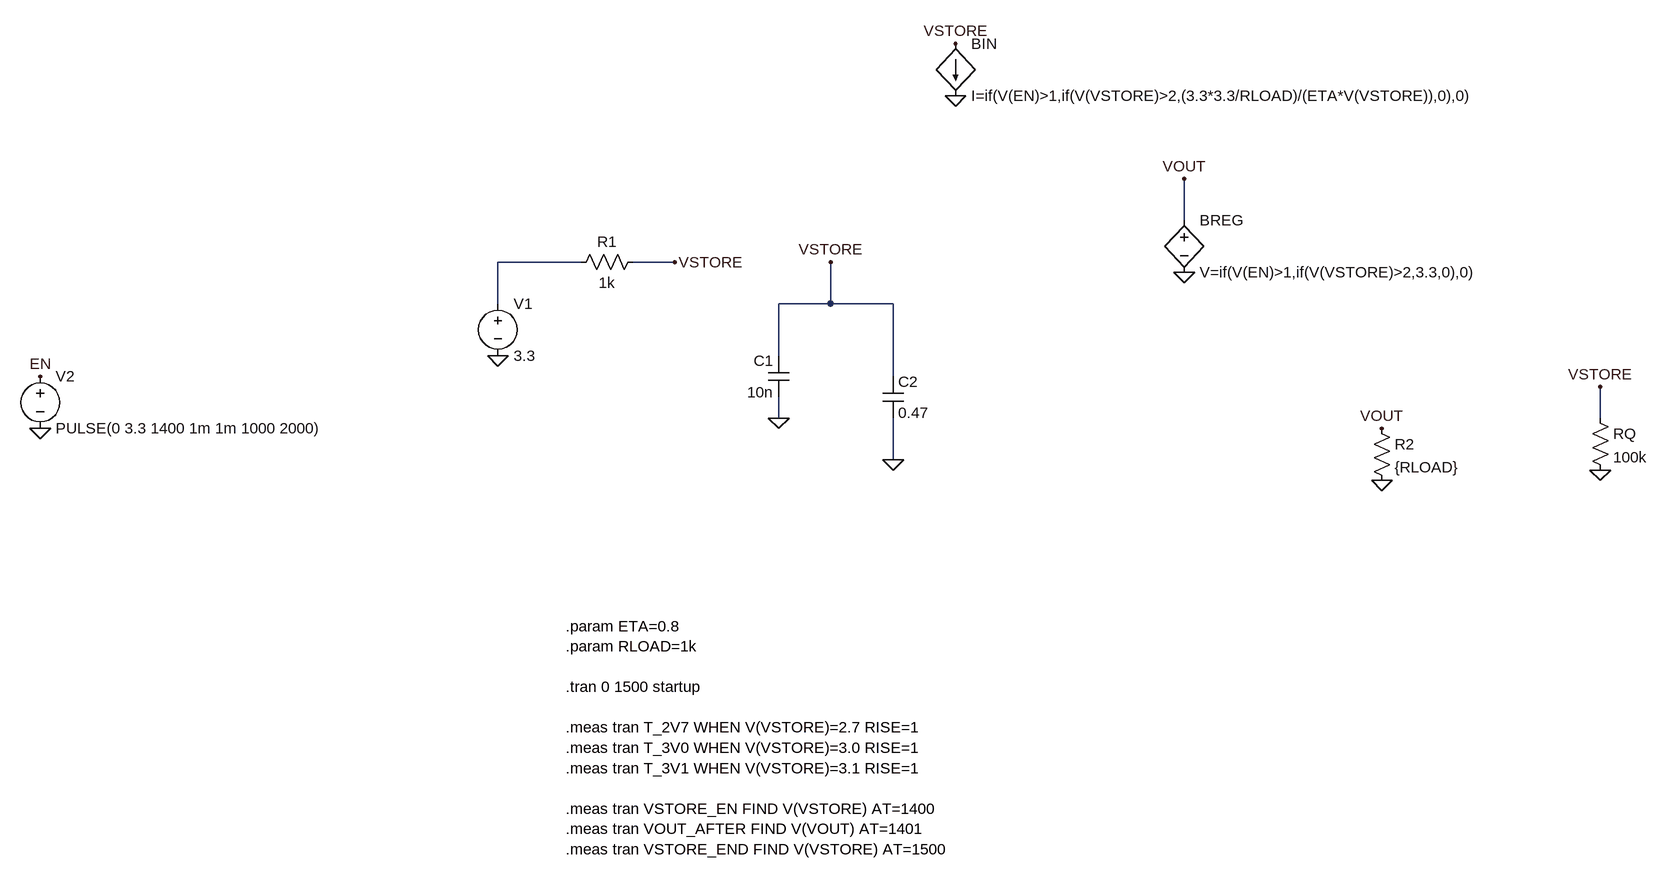
[diagram p0: schematic Stage2B_Regulator_1k_Load.asc]
Stage2B_Regulator_1k_Load.asc, the LTspice schematic file:
Version 4.1
SHEET 1 1820 1012
WIRE 1088 16 1088 -48
WIRE 160 80 32 80
WIRE 304 80 240 80
WIRE 32 144 32 80
WIRE 544 144 544 80
WIRE 544 144 464 144
WIRE 640 144 544 144
WIRE 464 224 464 144
WIRE 640 256 640 144
WIRE 464 320 464 288
WIRE 1728 320 1728 272
WIRE 640 384 640 320
FLAG 32 224 0
FLAG 304 80 VSTORE
FLAG 544 80 VSTORE
FLAG 640 384 0
FLAG 464 320 0
FLAG -672 336 0
FLAG -672 256 EN
FLAG 1088 96 0
FLAG 1088 -48 VOUT
FLAG 736 -256 VSTORE
FLAG 736 -176 0
FLAG 1392 416 0
FLAG 1392 336 VOUT
FLAG 1728 400 0
FLAG 1728 272 VSTORE
SYMBOL voltage 32 128 R0
SYMATTR InstName V1
SYMATTR Value 3.3
SYMBOL res 256 64 R90
WINDOW 0 0 56 VBottom 2
WINDOW 3 32 56 VTop 2
SYMATTR InstName R1
SYMATTR Value 1k
SYMBOL cap 480 288 R180
WINDOW 0 24 56 Left 2
WINDOW 3 24 8 Left 2
SYMATTR InstName C1
SYMATTR Value 10n
SYMBOL cap 624 256 R0
SYMATTR InstName C2
SYMATTR Value 0.47
SYMBOL voltage -672 240 R0
SYMATTR InstName V2
SYMATTR Value PULSE(0 3.3 1400 1m 1m 1000 2000)
SYMBOL bv 1088 0 R0
SYMATTR InstName BREG
SYMATTR Value V=if(V(EN)>1,if(V(VSTORE)>2,3.3,0),0)
SYMBOL bi 736 -256 R0
SYMATTR InstName BIN
SYMATTR Value I=if(V(EN)>1,if(V(VSTORE)>2,(3.3*3.3/RLOAD)/(ETA*V(VSTORE)),0),0)
SYMBOL res 1376 320 R0
SYMATTR InstName R2
SYMATTR Value {RLOAD}
SYMBOL res 1712 304 R0
SYMATTR InstName RQ
SYMATTR Value 100k
TEXT 136 640 Left 2 !.param ETA=0.8\n.param RLOAD=1k\n \n.tran 0 1500 startup\n \n.meas tran T_2V7 WHEN V(VSTORE)=2.7 RISE=1\n.meas tran T_3V0 WHEN V(VSTORE)=3.0 RISE=1\n.meas tran T_3V1 WHEN V(VSTORE)=3.1 RISE=1\n \n.meas tran VSTORE_EN FIND V(VSTORE) AT=1400\n.meas tran VOUT_AFTER FIND V(VOUT) AT=1401\n.meas tran VSTORE_END FIND V(VSTORE) AT=1500

The netlist it stands for:
* Stage2B_Regulator_1k_Load.asc
V1 N001 0 3.3
R1 VSTORE N001 1k
C1 0 VSTORE 10n
C2 VSTORE 0 0.47
V2 EN 0 PULSE(0 3.3 1400 1m 1m 1000 2000)
BREG VOUT 0 V=if(V(EN)>1,if(V(VSTORE)>2,3.3,0),0)
BIN VSTORE 0 I=if(V(EN)>1,if(V(VSTORE)>2,(3.3*3.3/RLOAD)/(ETA*V(VSTORE)),0),0)
R2 VOUT 0 {RLOAD}
RQ VSTORE 0 100k
.param ETA=0.8
.param RLOAD=1k
.tran 0 1500 startup
.meas tran T_2V7 WHEN V(VSTORE)=2.7 RISE=1
.meas tran T_3V0 WHEN V(VSTORE)=3.0 RISE=1
.meas tran T_3V1 WHEN V(VSTORE)=3.1 RISE=1
.meas tran VSTORE_EN FIND V(VSTORE) AT=1400
.meas tran VOUT_AFTER FIND V(VOUT) AT=1401
.meas tran VSTORE_END FIND V(VSTORE) AT=1500
.backanno
.end